# Altium schematic sheet v1.5 Touch & USB.SchDoc
size A4; DocumentNumber: 4; SheetNumber: 4
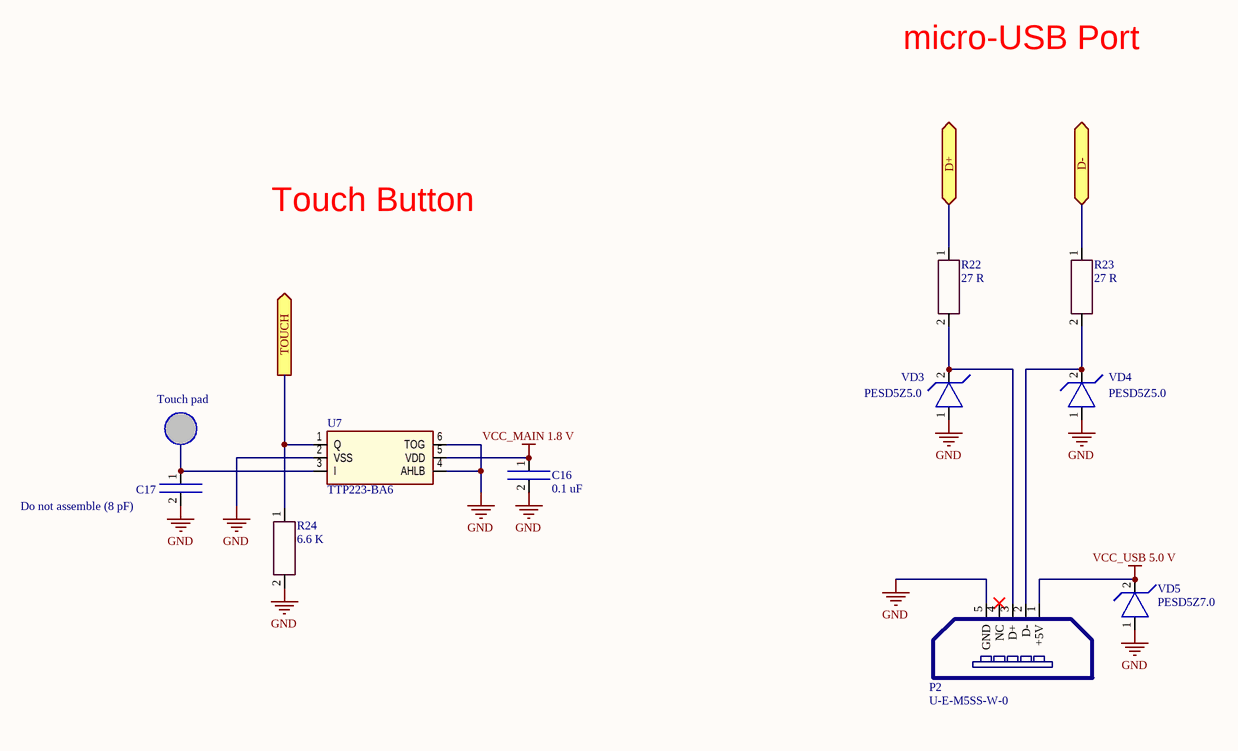
[diagram p0: v1.5 Touch & USB.SchDoc]

## Parts
C16  0.1 uF  [0402]
C17  Do not assemble (8 pF)  [0402]  (no BOM)
P2  U-E-M5SS-W-0  [U-E-M5SS-W-0]  (no BOM)
R22  27 R  [0402]
R23  27 R  [0402]
R24  6.6 K  [0402]
U7  TTP223-BA6  [SOT23-6]
VD3  PESD5Z5.0  [SOD-523]
VD4  PESD5Z5.0  [SOD-523]
VD5  PESD5Z7.0  [SOD-523]

## Ports
D+ (bidir), D- (bidir), TOUCH (out)

## Nets
GND: C16.2 C17.2 P2.5(GND) R24.2 U7.2(VSS) U7.4(AHLB) U7.6(TOG) VD3.1 VD4.1 VD5.1
VCC_MAIN 1.8 V: C16.1 U7.5(VDD)
VCC_USB 5.0 V: P2.1(+5V) VD5.2
D+: R22.1 ; port D+
D-: R23.1 ; port D-
TOUCH: R24.1 U7.1(Q) ; port TOUCH
NetC17_1: C17.1 U7.3(I)
NetP2_2: P2.2(D-) R23.2 VD4.2
NetP2_3: P2.3(D+) R22.2 VD3.2

Not connected (* = marked no-connect by the designer): P2 4(NC)*

## Notes on the sheet
- micro-USB Port
- Touch Button
- Touch pad

## Library data of the parts
C16 C17 = Capasistor
P2 = micro-USB port
R22-R24 = Resistor
VD3-VD5 = Stabilitron